# EAGLE design RATS_Schematic (EAGLE 9.6.2)
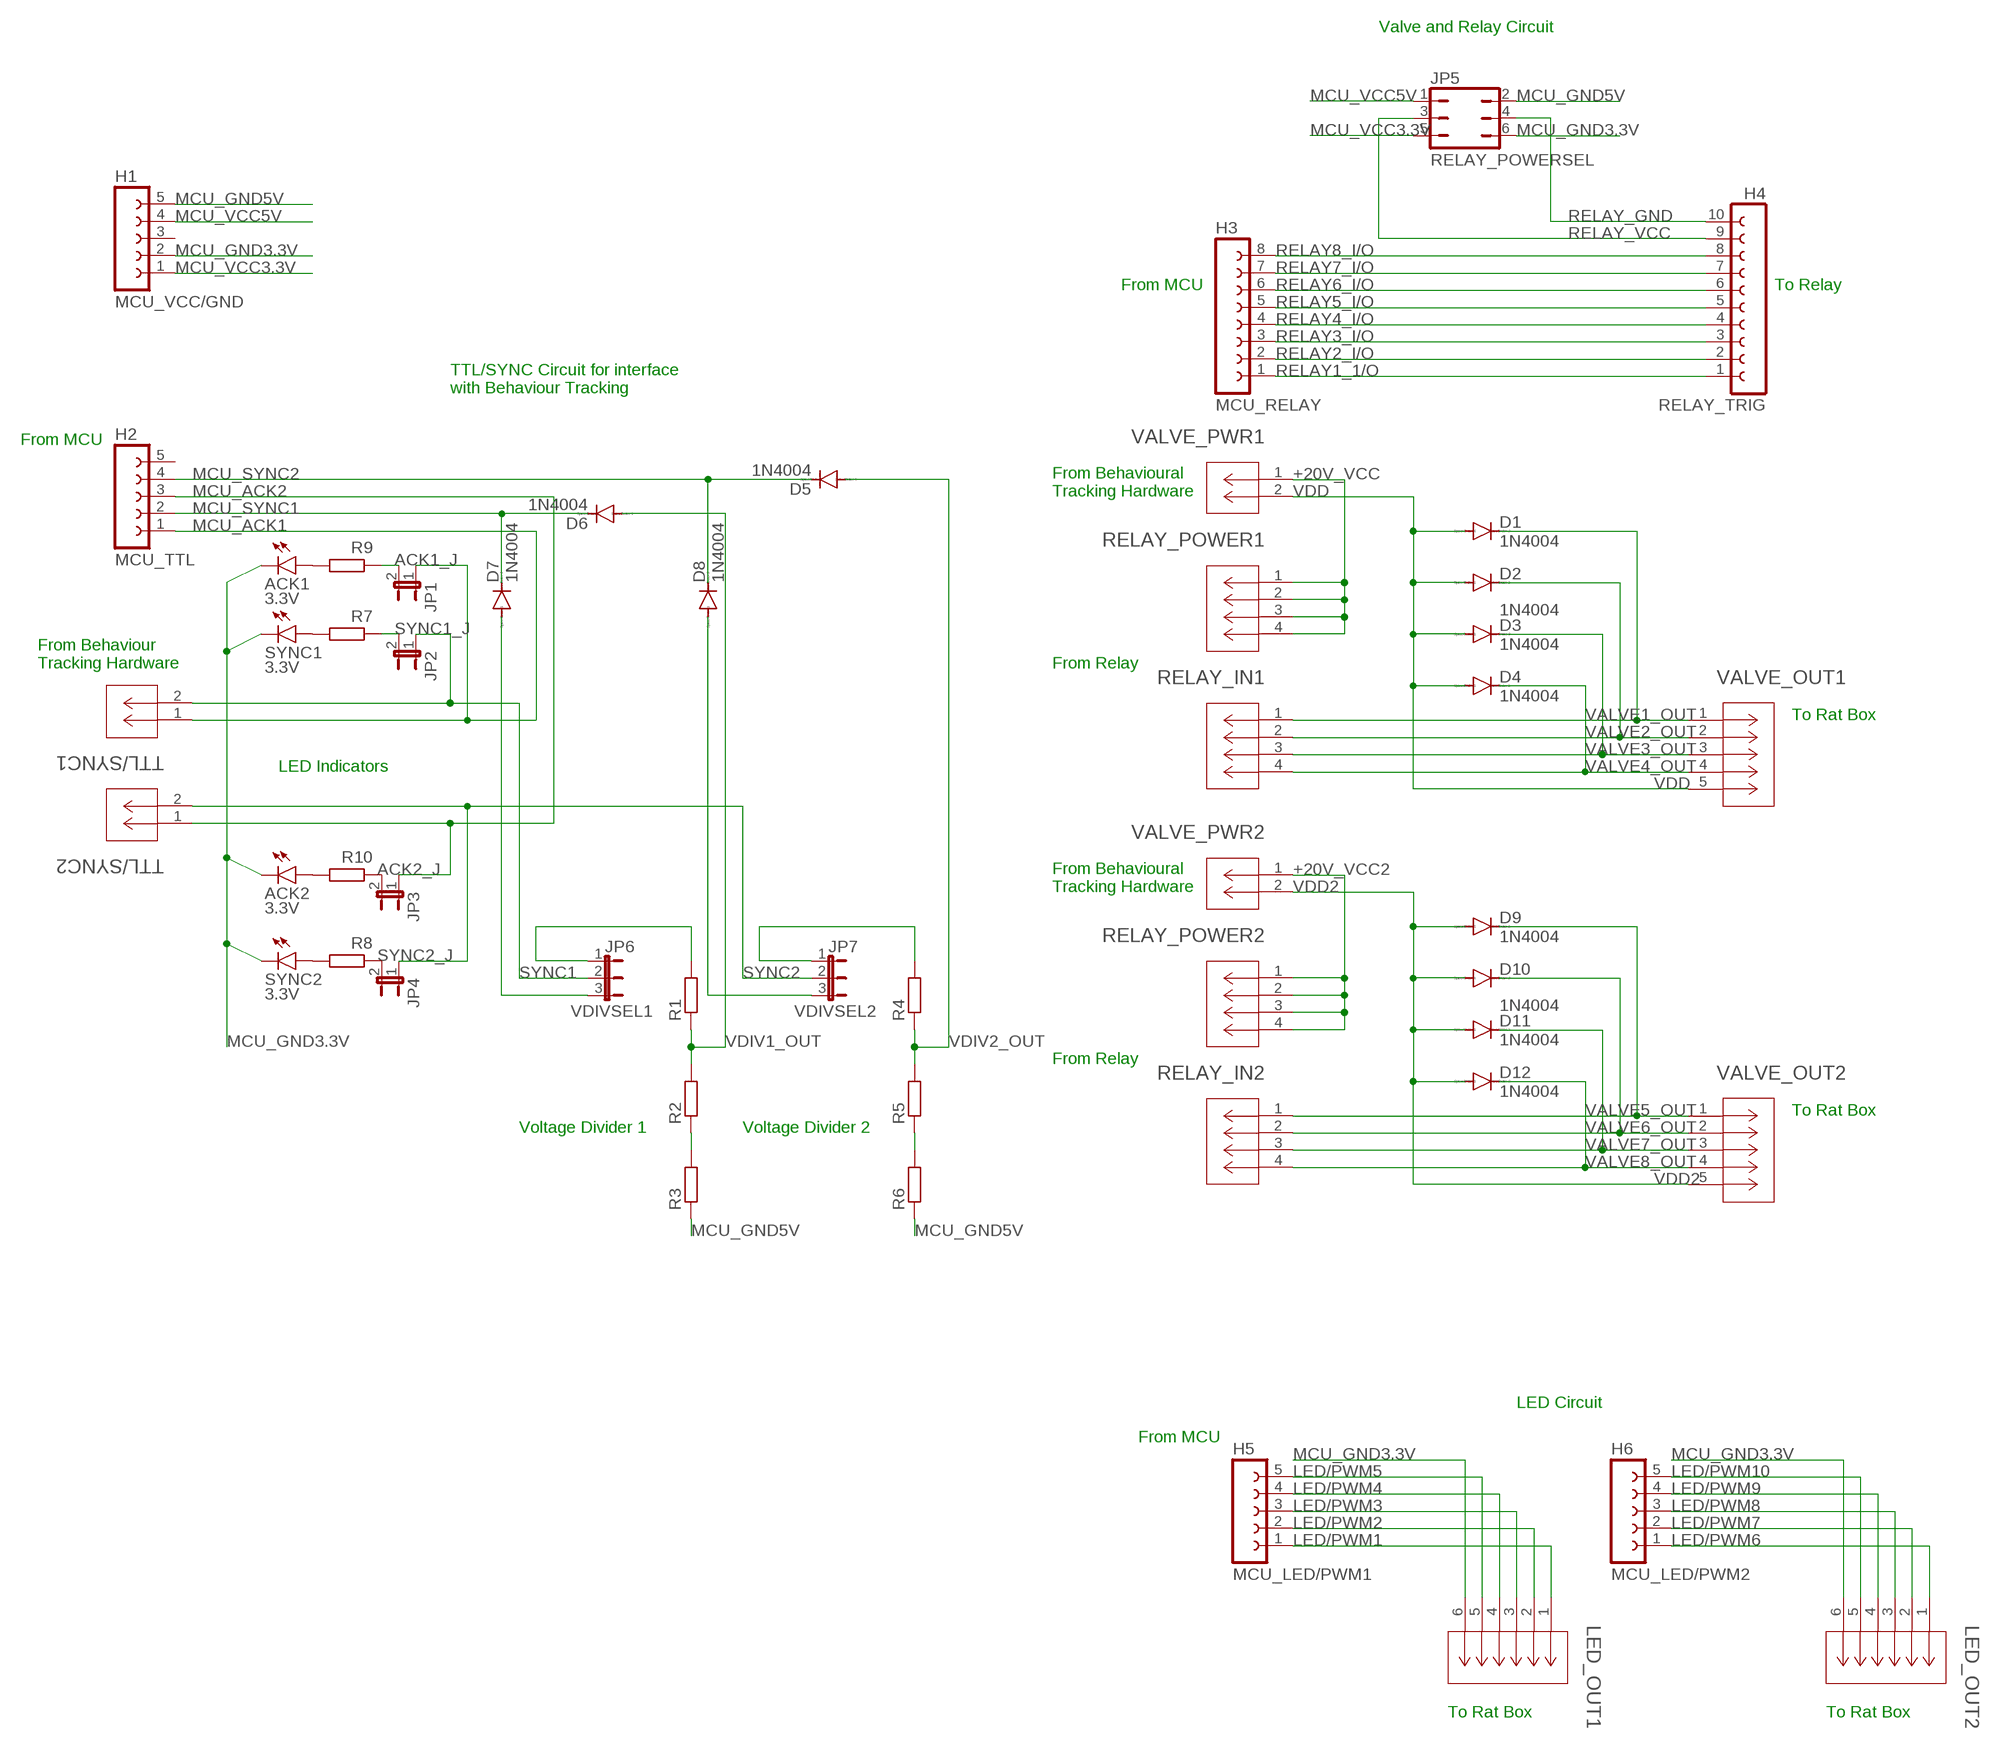
[diagram p0: schematic, sheet 1]

## Parts
ACK1  3.3V  LED5MM  [LED5MM]
ACK2  3.3V  LED5MM  [LED5MM]
D1  1N4004  [DO41-10]
D2  1N4004  [DO41-10]
D3  1N4004  [DO41-10]
D4  1N4004  [DO41-10]
D5  1N4004  [DO41-10]
D6  1N4004  [DO41-10]
D7  1N4004  [DO41-10]
D8  1N4004  [DO41-10]
D9  1N4004  [DO41-10]
D10  1N4004  [DO41-10]
D11  1N4004  [DO41-10]
D12  1N4004  [DO41-10]
H1  MCU_VCC/GND  FE05-1  [FE05-1]
H2  MCU_TTL  FE05-1  [FE05-1]
H3  MCU_RELAY  FE08-1  [FE08]
H4  RELAY_TRIG  FE10-1  [FE10]
H5  MCU_LED/PWM1  FE05-1  [FE05-1]
H6  MCU_LED/PWM2  FE05-1  [FE05-1]
JP1  ACK1_J  JP1E  [JP1]
JP2  SYNC1_J  JP1E  [JP1]
JP3  ACK2_J  JP1E  [JP1]
JP4  SYNC2_J  JP1E  [JP1]
JP5  RELAY_POWERSEL  JP3Q  [JP3Q]
JP6  VDIVSEL1  JP2E  [JP2]
JP7  VDIVSEL2  JP2E  [JP2]
LED_OUT1  B6B-XH-A(LF)(SN)  [CONN_B6B-XH-A(LF)(SN)_JST]
LED_OUT2  B6B-XH-A(LF)(SN)  [CONN_B6B-XH-A(LF)(SN)_JST]
R1  R-EU_0204/7  [0204/7]
R2  R-EU_0204/7  [0204/7]
R3  R-EU_0204/7  [0204/7]
R4  R-EU_0204/7  [0204/7]
R5  R-EU_0204/7  [0204/7]
R6  R-EU_0204/7  [0204/7]
R7  R-EU_0204/7  [0204/7]
R8  R-EU_0204/7  [0204/7]
R9  R-EU_0204/7  [0204/7]
R10  R-EU_0204/7  [0204/7]
RELAY_IN1  B4B-XH-A_(LF)(SN)  [CONN_B4B-XH-A_(LF)(SN)_JST]
RELAY_IN2  B4B-XH-A_(LF)(SN)  [CONN_B4B-XH-A_(LF)(SN)_JST]
RELAY_POWER1  B4B-XH-A_(LF)(SN)  [CONN_B4B-XH-A_(LF)(SN)_JST]
RELAY_POWER2  B4B-XH-A_(LF)(SN)  [CONN_B4B-XH-A_(LF)(SN)_JST]
SYNC1  3.3V  LED5MM  [LED5MM]
SYNC2  3.3V  LED5MM  [LED5MM]
TTL/SYNC1  B2B-XH-A(LF)(SN)  [CONN_B2B-XH-A(LF)(SN)_JST]
TTL/SYNC2  B2B-XH-A(LF)(SN)  [CONN_B2B-XH-A(LF)(SN)_JST]
VALVE_OUT1  B5B-XH-A(LF)(SN)  [CONN_B5B-XH-A(LF)(SN)_JST]
VALVE_OUT2  B5B-XH-A(LF)(SN)  [CONN_B5B-XH-A(LF)(SN)_JST]
VALVE_PWR1  B2B-XH-A(LF)(SN)  [CONN_B2B-XH-A(LF)(SN)_JST]
VALVE_PWR2  B2B-XH-A(LF)(SN)  [CONN_B2B-XH-A(LF)(SN)_JST]

## Nets
+20V_VCC: RELAY_POWER1.1 RELAY_POWER1.2 RELAY_POWER1.3 RELAY_POWER1.4 VALVE_PWR1.1
+20V_VCC2: RELAY_POWER2.1 RELAY_POWER2.2 RELAY_POWER2.3 RELAY_POWER2.4 VALVE_PWR2.1
LED/PWM1: H5.1 LED_OUT1.1
LED/PWM2: H5.2 LED_OUT1.2
LED/PWM3: H5.3 LED_OUT1.3
LED/PWM4: H5.4 LED_OUT1.4
LED/PWM5: H5.5 LED_OUT1.5
LED/PWM6: H6.1 LED_OUT2.1
LED/PWM7: H6.2 LED_OUT2.2
LED/PWM8: H6.3 LED_OUT2.3
LED/PWM9: H6.4 LED_OUT2.4
LED/PWM10: H6.5 LED_OUT2.5
MCU_ACK1: H2.1 JP1.1 TTL/SYNC1.1
MCU_ACK2: H2.3 JP3.1 TTL/SYNC2.1
MCU_GND3.3V: ACK1.K(C) ACK2.K(C) H1.2 JP5.6 LED_OUT1.6 LED_OUT2.6 SYNC1.K(C) SYNC2.K(C)
MCU_GND5V: H1.5 JP5.2 R3.1 R6.1
MCU_SYNC1: D6.C D7.C H2.2
MCU_SYNC2: D5.C D8.C H2.4
MCU_VCC3.3V: H1.1 JP5.5
MCU_VCC5V: H1.4 JP5.1
N$1: R7.2 SYNC1.A
N$2: R8.2 SYNC2.A
N$3: R2.1 R3.2
N$4: JP6.1 R1.2
N$5: D7.A JP6.3
N$6: D8.A JP7.3
N$7: JP7.1 R4.2
N$8: ACK1.A R9.2
N$9: R5.1 R6.2
N$10: ACK2.A R10.2
N$11: JP2.2 R7.1
N$12: JP1.2 R9.1
N$13: JP3.2 R10.1
N$14: JP4.2 R8.1
RELAY1_1/O: H3.1 H4.1
RELAY2_I/O: H3.2 H4.2
RELAY3_I/O: H3.3 H4.3
RELAY4_I/O: H3.4 H4.4
RELAY5_I/O: H3.5 H4.5
RELAY6_I/O: H3.6 H4.6
RELAY7_I/O: H3.7 H4.7
RELAY8_I/O: H3.8 H4.8
RELAY_GND: H4.10 JP5.4
RELAY_VCC: H4.9 JP5.3
SYNC1: JP2.1 JP6.2 TTL/SYNC1.2
SYNC2: JP4.1 JP7.2 TTL/SYNC2.2
VALVE1_OUT: D1.C RELAY_IN1.1 VALVE_OUT1.1
VALVE2_OUT: D2.C RELAY_IN1.2 VALVE_OUT1.2
VALVE3_OUT: D3.C RELAY_IN1.3 VALVE_OUT1.3
VALVE4_OUT: D4.C RELAY_IN1.4 VALVE_OUT1.4
VALVE5_OUT: D9.C RELAY_IN2.1 VALVE_OUT2.1
VALVE6_OUT: D10.C RELAY_IN2.2 VALVE_OUT2.2
VALVE7_OUT: D11.C RELAY_IN2.3 VALVE_OUT2.3
VALVE8_OUT: D12.C RELAY_IN2.4 VALVE_OUT2.4
VDD: D1.A D2.A D3.A D4.A VALVE_OUT1.5 VALVE_PWR1.2
VDD2: D9.A D10.A D11.A D12.A VALVE_OUT2.5 VALVE_PWR2.2
VDIV1_OUT: D6.A R1.1 R2.2
VDIV2_OUT: D5.A R4.1 R5.2
Unconnected: H1.3 H2.5

## Notes on the sheet
- Valve and Relay Circuit
- From MCU | To Relay
- TTL/SYNC Circuit for interface
  with Behaviour Tracking
- From MCU
- From Behavioural
  Tracking Hardware
- From Behaviour
  Tracking Hardware
- From Relay
- To Rat Box
- LED Indicators
- From Behavioural
  Tracking Hardware
- From Relay
- To Rat Box
- Voltage Divider 1 | Voltage Divider 2
- LED Circuit
- From MCU
- To Rat Box | To Rat Box

## Library data of the parts
ACK1 ACK2 SYNC1 SYNC2 = led:LED: LED OSRAM: - CHIPLED LG R971, LG N971, LY N971, LG Q971, LY Q971, LO R971, LY R971 LH N974, LH R974 LS Q976, LO Q976, LY Q976 LO Q996 - Hyper CHIPLED LW Q18S LB Q993, LB Q99A, LB R99A - SideLED LS A670, LO A670, LY A670, LG A670, LP A670 LB A673, LV A673, LT A673, LW A673 LH A674 LY A675 LS A676, LA A676, LO A676, LY A676, LW A676 LS A679, LY A679, LG A679 - Hyper Micro SIDELED® LS Y876, LA Y876, LO Y876, LY Y876 LT Y87S - SmartLED LW L88C, LW L88S LB L89C, LB L89S, LG L890 LS L89K, LO L89K, LY L89K LS L896, LA L896, LO L896, LY L896 - TOPLED LS T670, LO T670, LY T670, LG T670, LP T670 LSG T670, LSP T670, LSY T670, LOP T670, LYG T670 LG T671, LOG T671, LSG T671 LB T673, LV T673, LT T673, LW T673 LH T674 LS T676, LA T676, LO T676, LY T676, LB T676, LH T676, LSB T676, LW T676 LB T67C, LV T67C, LT T67C, LS T67K, LO T67K, LY T67K, LW E67C LS E67B, LA E67B, LO E67B, LY E67B, LB E67C, LV E67C, LT E67C LW T67C LS T679, LY T679, LG T679 LS T770, LO T770, LY T770, LG T770, LP T770 LB T773, LV T773, LT T773, LW T773 LH T774 LS E675, LA E675, LY E675, LS T675 LS T776, LA T776, LO T776, LY T776, LB T776 LHGB T686 LT T68C, LB T68C - Hyper Mini TOPLED® LB M676 - Mini TOPLED Santana® LG M470 LS M47K, LO M47K, LY M47K Source: http://www.osram.convergy.de LUXEON: - LUMILED® LXK2-PW12-R00, LXK2-PW12-S00, LXK2-PW14-U00, LXK2-PW14-V00 LXK2-PM12-R00, LXK2-PM12-S00, LXK2-PM14-U00 LXK2-PE12-Q00, LXK2-PE12-R00, LXK2-PE12-S00, LXK2-PE14-T00, LXK2-PE14-U00 LXK2-PB12-K00, LXK2-PB12-L00, LXK2-PB12-M00, LXK2-PB14-N00, LXK2-PB14-P00, LXK2-PB14-Q00 LXK2-PR12-L00, LXK2-PR12-M00, LXK2-PR14-Q00, LXK2-PR14-R00 LXK2-PD12-Q00, LXK2-PD12-R00, LXK2-PD12-S00 LXK2-PH12-R00, LXK2-PH12-S00 LXK2-PL12-P00, LXK2-PL12-Q00, LXK2-PL12-R00 Source: www.luxeon.com KINGBRIGHT: KA-3528ASYC Source: www.kingbright.com
D1-D12 = diode:1N4004: DIODE general purpose rectifier, 1 A
H1 H2 H5 H6 = con-lsta:FE05-1: FEMALE HEADER; OC_FARNELL: unknown; OC_NEWARK: unknown
H3 = con-lsta:FE08-1: FEMALE HEADER; OC_FARNELL: unknown; OC_NEWARK: unknown
H4 = con-lsta:FE10-1: FEMALE HEADER; OC_FARNELL: unknown; OC_NEWARK: unknown
JP1-JP4 = jumper:JP1E: JUMPER
JP5 = jumper:JP3Q: JUMPER
JP6 JP7 = jumper:JP2E: JUMPER
LED_OUT1 LED_OUT2 = RatCage_Components:B6B-XH-A(LF)(SN); COPYRIGHT: Copyright (C) 2021 Ultra Librarian. All rights reserved.; MANUFACTURER_PART_NUMBER: B6B-XH-A(LF)(SN); MFR_NAME: JST
R1-R10 = rcl:R-EU_: RESISTOR, European symbol; SPICEPREFIX: R
RELAY_IN1 RELAY_IN2 RELAY_POWER1 RELAY_POWER2 = RatCage_Components:B4B-XH-A_(LF)(SN); COPYRIGHT: Copyright (C) 2021 Ultra Librarian. All rights reserved.; MANUFACTURER_PART_NUMBER: B4B-XH-A (LF)(SN); MFR_NAME: JST
TTL/SYNC1 TTL/SYNC2 VALVE_PWR1 VALVE_PWR2 = RatCage_Components:B2B-XH-A(LF)(SN); COPYRIGHT: Copyright (C) 2021 Ultra Librarian. All rights reserved.; MANUFACTURER_PART_NUMBER: B2B-XH-A(LF)(SN); MFR_NAME: JST
VALVE_OUT1 VALVE_OUT2 = RatCage_Components:B5B-XH-A(LF)(SN); COPYRIGHT: Copyright (C) 2021 Ultra Librarian. All rights reserved.; MANUFACTURER_PART_NUMBER: B5B-XH-A(LF)(SN); MFR_NAME: JST

## Board
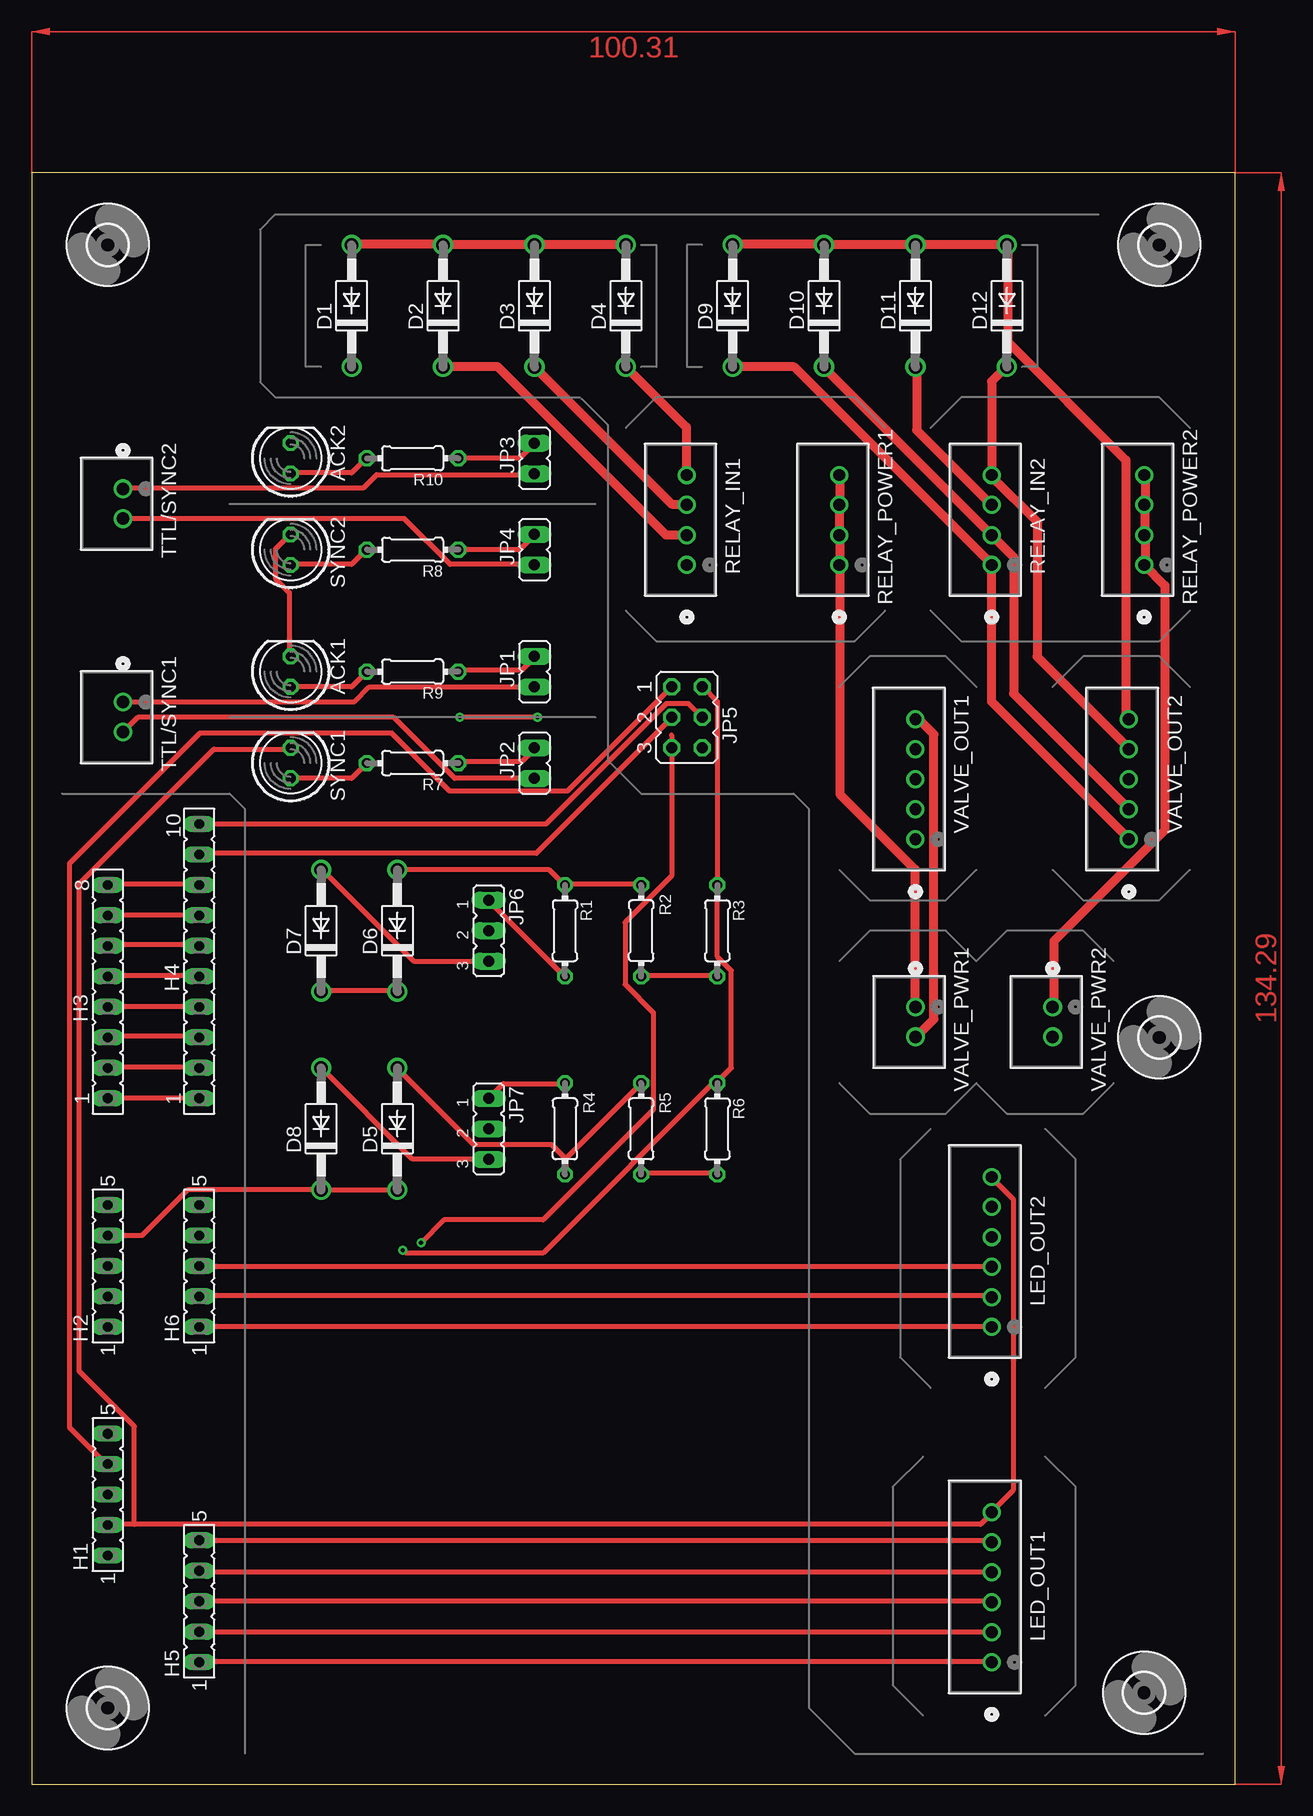
[diagram p1: board, top side]
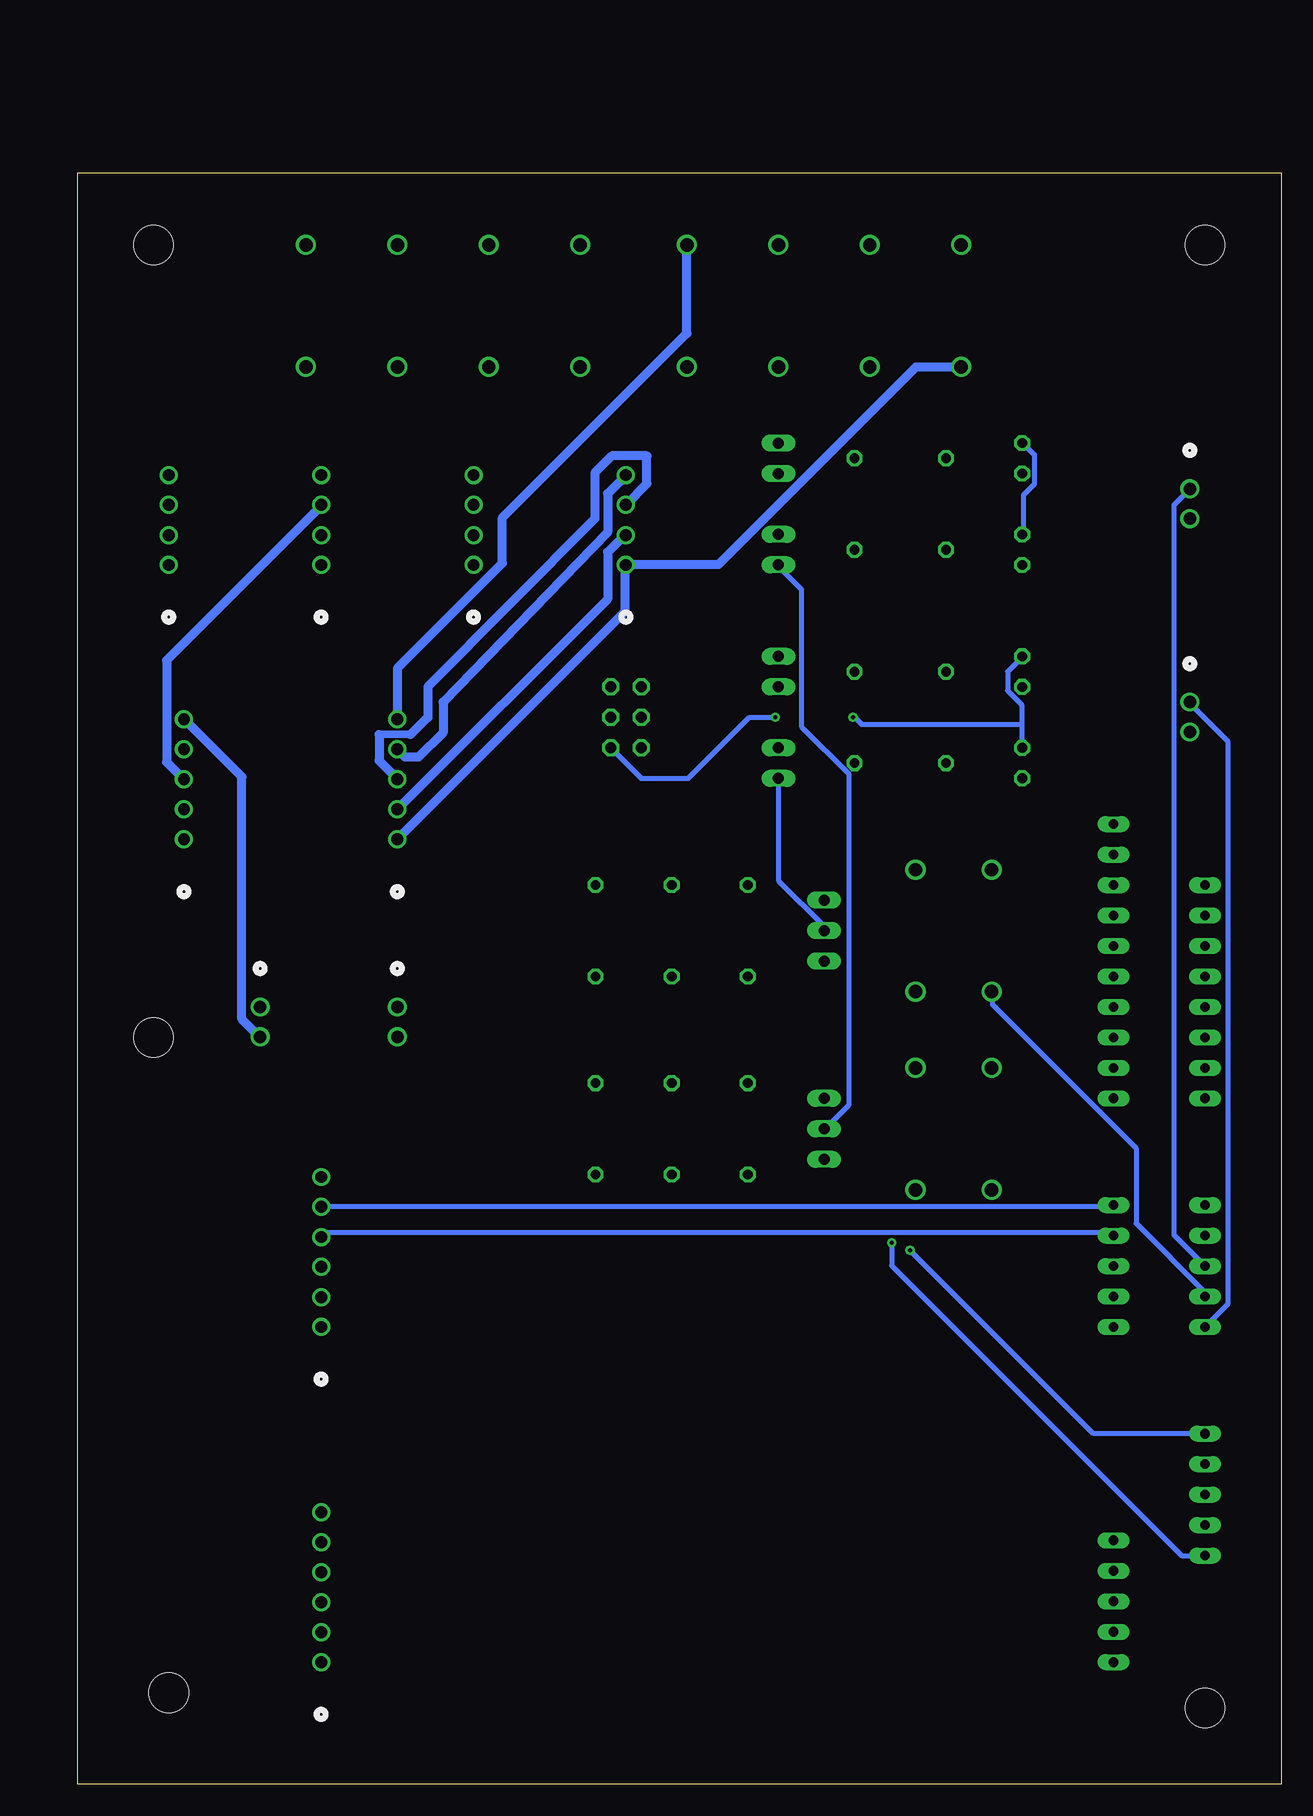
[diagram p2: board, bottom side, seen from below]

Size 100.31 x 134.29 mm. Coordinates in mm from the lower left corner, seen from the top.
Outline: 0,134.29 0,0 100.31,0 100.31,134.29 0,134.29
Copper layers (1*16): Top 0.035mm / dielectric 1.5mm / Bottom 0.035mm
Design rules "default": minimum track width 6mil, minimum drill 0.35mm, track to track 6mil, track to pad 6mil, pad to pad 6mil, via to via 6mil, smd to smd 6mil, copper to edge 40mil, drill to drill 6mil, minimum pad ring 10mil, minimum via ring 8mil, stop-mask expansion 4mil, vias tented up to drill 0mil, thermal gap 10mil

### Footprints (pad centres in the part's own frame; a part is rotated, then mirrored left to right if it is on the bottom)
LED5MM = drill 0.813 octagon: A -1.27,0; K 1.27,0
DO41-10 = drill 1.118: A 5.08,0; C -5.08,0
FE05-1 = drill 0.813 long: 1 -5.08,0; 2 -2.54,0; 3 0,0; 4 2.54,0; 5 5.08,0
FE08 = drill 0.813 long: 1 -8.89,0; 2 -6.35,0; 3 -3.81,0; 4 -1.27,0; 5 1.27,0; 6 3.81,0; 7 6.35,0; 8 8.89,0
FE10 = drill 0.813 long: 1 -11.43,0; 2 -8.89,0; 3 -6.35,0; 4 -3.81,0; 5 -1.27,0; 6 1.27,0; 7 3.81,0; 8 6.35,0; 9 8.89,0; 10 11.43,0
JP1 = drill 0.914 long: 1 0,-1.27; 2 0,1.27
JP3Q = drill 0.914 octagon: 1 -2.54,-1.27; 2 -2.54,1.27; 3 0,-1.27; 4 0,1.27; 5 2.54,-1.27; 6 2.54,1.27
JP2 = drill 0.914 long: 1 -2.54,0; 2 0,0; 3 2.54,0
CONN_B6B-XH-A(LF)(SN)_JST = drill 0.991 pad 1.499: 1 0,0; 2 2.489,0; 3 5.004,0; 4 7.493,0; 5 10.008,0; 6 12.497,0
0204/7 = drill 0.813 octagon: 1 -3.81,0; 2 3.81,0
CONN_B4B-XH-A_(LF)(SN)_JST = drill 0.991 pad 1.499: 1 0,0; 2 2.489,0; 3 5.004,0; 4 7.493,0
CONN_B2B-XH-A(LF)(SN)_JST = drill 1.041 pad 1.549: 1 0,0; 2 -2.489,0
3,3 = hole 3.3: 0,0
CONN_B5B-XH-A(LF)(SN)_JST = drill 0.991 pad 1.499: 1 0,0; 2 2.489,0; 3 5.004,0; 4 7.493,0; 5 10.008,0

### Placement (x,y rotation side)
ACK1  21.59,92.71 90 top
ACK2  21.59,110.49 90 top
D1  26.67,123.19 90 top
D2  34.29,123.19 90 top
D3  41.91,123.19 90 top
D4  49.53,123.19 90 top
D5  30.48,54.61 90 top
D6  30.48,71.12 90 top
D7  24.13,71.12 90 top
D8  24.13,54.61 90 top
D9  58.42,123.19 90 top
D10  66.04,123.19 90 top
D11  73.66,123.19 90 top
D12  81.28,123.19 90 top
H1  6.35,24.13 90 top
H2  6.35,43.18 90 top
H3  6.35,66.04 90 top
H4  13.97,68.58 90 top
H5  13.97,15.24 90 top
H6  13.97,43.18 90 top
JP1  41.91,92.71 0 top
JP2  41.91,85.09 0 top
JP3  41.91,110.49 0 top
JP4  41.91,102.87 0 top
JP5  54.61,88.9 270 top
JP6  38.1,71.12 270 top
JP7  38.1,54.61 270 top
LED_OUT1  80.01,10.16 90 top
LED_OUT2  80.01,38.1 90 top
R1  44.45,71.12 270 top
R2  50.8,71.12 90 top
R3  57.15,71.12 270 top
R4  44.45,54.61 90 top
R5  50.8,54.61 90 top
R6  57.15,54.61 270 top
R7  31.75,85.09 180 top
R8  31.75,102.87 180 top
R9  31.75,92.71 180 top
R10  31.75,110.49 180 top
RELAY_IN1  54.61,101.6 90 top
RELAY_IN2  80.01,101.6 90 top
RELAY_POWER1  67.31,101.6 90 top
RELAY_POWER2  92.71,101.6 90 top
SYNC1  21.59,85.09 90 top
SYNC2  21.59,102.87 90 top
TTL/SYNC1  7.62,90.17 90 top
TTL/SYNC2  7.62,107.95 90 top
U$1  [3,3]  6.35,128.27 0 top
U$2  [3,3]  93.98,128.27 0 top
U$3  [3,3]  6.35,6.35 0 top
U$4  [3,3]  93.98,62.23 0 top
U$5  [3,3]  92.71,7.62 0 top
VALVE_OUT1  73.66,78.74 90 top
VALVE_OUT2  91.44,78.74 90 top
VALVE_PWR1  73.66,64.77 90 top
VALVE_PWR2  85.09,64.77 90 top

### Tracks (layer width: path | path; a pad name or v marks a point on that pad's centre or on a via)
+20V_VCC
  Top 0.406: 67.36,106.68 RELAY_POWER1.3 | 67.36,101.65 RELAY_POWER1.1
  Top 0.762: 67.36,106.68 67.36,108.97 RELAY_POWER1.4 | 67.36,104.09 67.36,101.65 | VALVE_PWR1.1 73.61,64.77 73.61,76.25 67.36,82.5 67.36,101.5 RELAY_POWER1.1 | 67.36,104.09 67.36,106.53 RELAY_POWER1.3 | 67.36,104.09 RELAY_POWER1.2
+20V_VCC2
  Top 0.406: 92.81,106.68 RELAY_POWER2.3 | 92.81,101.65 RELAY_POWER2.1 | 85.19,64.77 VALVE_PWR2.1
  Top 0.762: 92.81,106.68 92.81,108.97 RELAY_POWER2.4 | 92.81,104.09 92.81,101.65 | 85.19,64.77 85.19,70.26 94.44,79.5 94.44,99.87 RELAY_POWER2.1 | 92.81,104.09 92.81,106.53 RELAY_POWER2.3 | 92.81,104.09 RELAY_POWER2.2
LED/PWM1
  Top 0.406: H5.1 14.02,10.21 80.01,10.21 LED_OUT1.1
LED/PWM2
  Top 0.406: LED_OUT1.2 14.02,12.65 H5.2
LED/PWM3
  Top 0.406: H5.3 80.01,15.24 LED_OUT1.3
LED/PWM4
  Top 0.406: H5.4 14.02,17.68 80.01,17.68 LED_OUT1.4
LED/PWM5
  Top 0.406: H5.5 14.02,20.27 80.01,20.27 LED_OUT1.5
LED/PWM6
  Top 0.406: LED_OUT2.1 H6.1
LED/PWM7
  Top 0.406: H6.2 14.02,40.69 80.01,40.69 LED_OUT2.2
LED/PWM8
  Top 0.406: H6.3 14.02,43.13 80.01,43.13 LED_OUT2.3
LED/PWM9
  Bottom 0.406: H6.4 14.22,45.97 80.01,45.97 LED_OUT2.4
LED/PWM10
  Bottom 0.406: H6.5 14.02,48.16 80.01,48.16 LED_OUT2.5
MCU_ACK1
  Top 0.406: JP1.1 28.14,91.44 26.92,90.22 7.62,90.22 TTL/SYNC1.1
  Bottom 0.406: H2.1 6.25,38.1 6.25,38.2 4.47,39.98 4.47,86.92 7.62,90.07 TTL/SYNC1.1
MCU_ACK2
  Top 0.406: JP3.1 41.91,109.12 28.75,109.12 27.69,108.05 7.62,108.05 TTL/SYNC2.1
  Bottom 0.406: H2.3 8.94,45.77 8.94,106.58 7.62,107.9 TTL/SYNC2.1
MCU_GND3.3V  (via drill 0.35)
  Top 0.406: ACK1.K 21.49,94.03 21.49,99.29 20.32,100.46 20.32,102.92 21.49,104.09 SYNC2.K | 8.56,21.64 79.1,21.64 80.01,22.55 LED_OUT1.6 80.01,22.71 81.84,24.54 81.84,48.72 80.01,50.55 LED_OUT2.6 | 8.56,21.64 6.4,21.64 H1.2 | 8.56,21.64 8.56,29.82 3.96,34.42 3.96,75.03 15.19,86.26 21.49,86.26 SYNC1.K | v42.16,88.9 v35.69,88.9 35.56,88.77
  Bottom 0.406: 21.64,88.32 21.64,89.97 22.81,91.13 22.81,92.71 21.64,93.88 ACK1.K | 21.64,88.32 21.64,86.41 SYNC1.K | SYNC2.K 21.49,104.24 21.49,107.42 20.57,108.33 20.57,110.79 21.49,111.71 ACK2.K | JP5.6 53.34,83.82 49.4,83.82 44.32,88.9 v42.16,88.9 | v35.69,88.9 35.56,88.9 34.98,88.32 21.64,88.32
MCU_GND5V  (via drill 0.35)
  Top 0.406: JP5.2 55.93,91.44 57.15,90.22 R3.1 57.15,68.96 58.32,67.79 58.32,59.69 57.15,58.52 | v30.94,44.5 31.19,44.25 42.62,44.25 57.15,58.78 57.15,58.52 | 57.15,58.52 R6.1
  Bottom 0.406: v30.94,44.5 15.7,29.26 6.4,29.26 H1.5
MCU_SYNC1
  Top 0.406: D6.C 30.48,66.14 24.23,66.14 D7.C
  Bottom 0.406: H2.2 6.4,40.69 6.4,41.05 12.09,46.74 12.09,52.98 24.08,64.97 24.08,65.99 D7.C
MCU_SYNC2
  Top 0.406: H2.4 9.2,45.72 13.01,49.53 D8.C D5.C
MCU_VCC3.3V  (via drill 0.35)
  Top 0.406: v32.46,45.11 34.37,47.02 42.62,47.02 51.82,56.21 51.82,64.29 49.45,66.65 49.45,71.81 53.34,75.69 JP5.5 53.34,87.43
  Bottom 0.406: v32.46,45.11 32.46,43.2 8.31,19.05 H1.1
MCU_VCC5V
  Top 0.406: H1.4 6.22,26.67 3.15,29.74 3.15,76.71 14.02,87.58 30.02,87.58 34.85,82.75 44.65,82.75 JP5.1
N$1
  Top 0.406: SYNC1.A 26.67,83.82 R7.2
N$2
  Top 0.406: SYNC2.A 21.64,101.65 26.67,101.65 27.89,102.87 R8.2
N$3
  Top 0.406: R2.1 50.9,67.36 57.15,67.36 R3.2
N$4
  Top 0.406: R1.2 44.35,67.36 38.1,73.61 JP6.1
N$5
  Top 0.406: JP6.3 31.85,68.58 24.23,76.2 D7.A
N$6
  Top 0.406: D8.A 31.7,52.12 38.1,52.12 JP7.3
N$7
  Top 0.406: JP7.1 39.32,58.37 44.35,58.37 R4.2
N$8
  Top 0.406: ACK1.A 26.67,91.44 R9.2
N$9
  Top 0.406: R5.1 50.9,50.9 57.15,50.9 R6.2
N$10
  Top 0.406: ACK2.A 21.64,109.27 26.67,109.27 27.89,110.49 R10.2
N$11
  Top 0.406: R7.1 35.66,85.19 40.84,85.19 41.91,86.26 JP2.2
N$12
  Top 0.406: R9.1 35.66,92.81 40.84,92.81 41.91,93.88 JP1.2
N$13
  Top 0.406: R10.1 40.69,110.49 41.91,111.71 JP3.2
N$14
  Top 0.406: R8.1 40.69,102.87 41.91,104.09 JP4.2
RELAY1_1/O
  Top 0.406: H4.1 H3.1
RELAY2_I/O
  Top 0.406: H3.2 6.4,59.74 13.87,59.74 H4.2
RELAY3_I/O
  Top 0.406: H3.3 6.4,62.33 13.87,62.33 H4.3
RELAY4_I/O
  Top 0.406: H4.4 H3.4
RELAY5_I/O
  Top 0.406: H3.5 6.4,67.36 13.87,67.36 H4.5
RELAY6_I/O
  Top 0.406: H3.6 6.4,69.95 13.87,69.95 H4.6
RELAY7_I/O
  Top 0.406: H4.7 H3.7
RELAY8_I/O
  Top 0.406: H3.8 6.4,74.98 13.87,74.98 H4.8
RELAY_GND
  Top 0.406: H4.10 42.85,80.01 52.88,90.04 54.74,90.04 JP5.4
RELAY_VCC
  Top 0.406: H4.9 14.02,77.57 42.06,77.57 53.34,88.85 JP5.3
SYNC1
  Top 0.406: TTL/SYNC1.2 8.84,88.9 30.18,88.9 35.26,83.82 JP2.1
  Bottom 0.406: JP6.2 38.1,71.48 41.91,75.29 JP2.1
SYNC2
  Top 0.406: TTL/SYNC2.2 31.06,105.46 34.87,101.65 41.91,101.65 JP4.1
  Bottom 0.406: JP7.2 38,54.61 36.04,56.57 36.04,84.2 39.98,88.14 39.98,99.57 41.91,101.5 JP4.1
VALVE1_OUT
  Bottom 0.406: 54.71,101.5 RELAY_IN1.1 54.56,101.65
  Bottom 0.762: VALVE_OUT1.1 54.71,97.69 54.71,101.5 | D1.C 30.43,118.11 46.89,101.65 54.56,101.65
VALVE2_OUT
  Top 0.762: D2.C 38.86,118.11 52.88,104.09 RELAY_IN1.2
  Bottom 0.406: 54.71,104.09 RELAY_IN1.2
  Bottom 0.762: 54.71,104.09 56.13,102.67 56.13,98.75 73.61,81.28 73.61,81.23 VALVE_OUT1.2
VALVE3_OUT
  Top 0.406: 54.56,106.68 RELAY_IN1.3
  Top 0.762: 54.56,106.68 53.34,106.68 D3.C
  Bottom 0.61: 72.54,87.48 75.18,87.48
  Bottom 0.762: 75.18,87.48 75.18,85.29 73.76,83.87 73.76,83.82 VALVE_OUT1.3 | 72.54,87.48 71.12,88.9 71.12,91.44 57.2,105.47 57.2,109.27 55.78,110.69 52.86,110.69 52.86,108.38 54.56,106.68 RELAY_IN1.3
VALVE4_OUT
  Top 0.406: 54.56,109.12 RELAY_IN1.4
  Top 0.762: 54.56,109.12 54.56,113.08 D4.C
  Bottom 0.406: 54.71,108.97 RELAY_IN1.4
  Bottom 0.762: VALVE_OUT1.4 73.03,85.6 71.88,85.6 69.85,87.63 69.85,90.17 56.13,104.32 56.13,107.54 54.71,108.97
VALVE5_OUT
  Top 0.406: 80.01,101.65 RELAY_IN2.1
  Top 0.762: RELAY_IN2.1 80.01,90.22 91.44,78.79 VALVE_OUT2.1 | D9.C 63.55,118.11 80.01,101.65
VALVE6_OUT
  Top 0.406: 65.99,118.11 D10.C
  Top 0.762: 65.99,118.11 RELAY_IN2.2 81.84,102.26 81.84,90.88 91.44,81.28 VALVE_OUT2.2
VALVE7_OUT
  Top 0.406: 73.76,118.11 D11.C
  Top 0.762: RELAY_IN2.3 79.98,106.6 73.76,112.83 73.76,118.11
  Bottom 0.406: 80.01,106.53 RELAY_IN2.3
  Bottom 0.762: VALVE_OUT2.3 91.47,83.74 92.89,85.17 92.89,93.65 80.01,106.53
VALVE8_OUT
  Top 0.406: 81.23,118.11 D12.C | 80.01,108.97 RELAY_IN2.4
  Top 0.762: RELAY_IN2.4 80.01,116.89 81.23,118.11 | VALVE_OUT2.4 91.44,86.31 83.8,93.95 83.8,105.18 80.01,108.97
VDD
  Top 0.406: 26.67,128.32 D1.A | 34.29,128.32 D2.A | 49.53,128.32 D4.A | 41.91,128.32 D3.A
  Top 0.762: 26.67,128.32 34.29,128.32 41.91,128.32 49.53,128.32 | VALVE_OUT1.5 73.91,88.75 75.18,87.48 75.18,63.75 73.76,62.33 VALVE_PWR1.2
  Bottom 0.762: D4.A 49.53,120.9 64.9,105.54 64.9,101.75 73.66,92.99 VALVE_OUT1.5
VDD2
  Top 0.406: 58.52,128.32 D9.A | 65.99,128.32 D10.A 66.14,128.32 | 73.61,128.32 D11.A 73.76,128.32 | 81.23,128.32 D12.A 81.38,128.17
  Top 0.762: 65.99,128.32 58.52,128.32 | 66.14,128.32 73.61,128.32 | 73.76,128.32 81.23,128.32 | 81.38,128.17 81.38,120.14 91.19,110.34 91.19,89 VALVE_OUT2.5
  Bottom 0.406: 85.19,62.33 VALVE_PWR2.2
  Bottom 0.762: VALVE_OUT2.5 91.42,88.75 86.61,83.95 86.61,63.75 85.19,62.33
VDIV1_OUT
  Top 0.406: R2.2 50.75,74.98 44.5,74.98 R1.1 44.35,74.98 43.13,76.2 D6.A
VDIV2_OUT
  Top 0.406: 44.5,52.12 44.5,50.9 R4.1 | R5.2 44.5,52.12 | D5.A 30.61,59.56 30.61,59.54 36.85,53.29 43.33,53.29 44.5,52.12
(copper drawn outside any net)
  shapes: Top area x2

### Text on the board
tDocu: 1 | 2 | CONN12 | CONN7 | CONN9 | CONN8 | CONN10 | 1 | 2 | CONN11 | Hardware Synchronization | Voltage Divider 1 | CONN5 | CONN6 | 1 | 2 | Voltage Divider 2 | CONN3 | CONN4 | 1 | 2 | CONN2 | To Cages | To Microcontroller | CONN1 | PCB Revision 1.0